# EAGLE design brick_serial_bluetooth_wt11i (EAGLE 7.2.0)
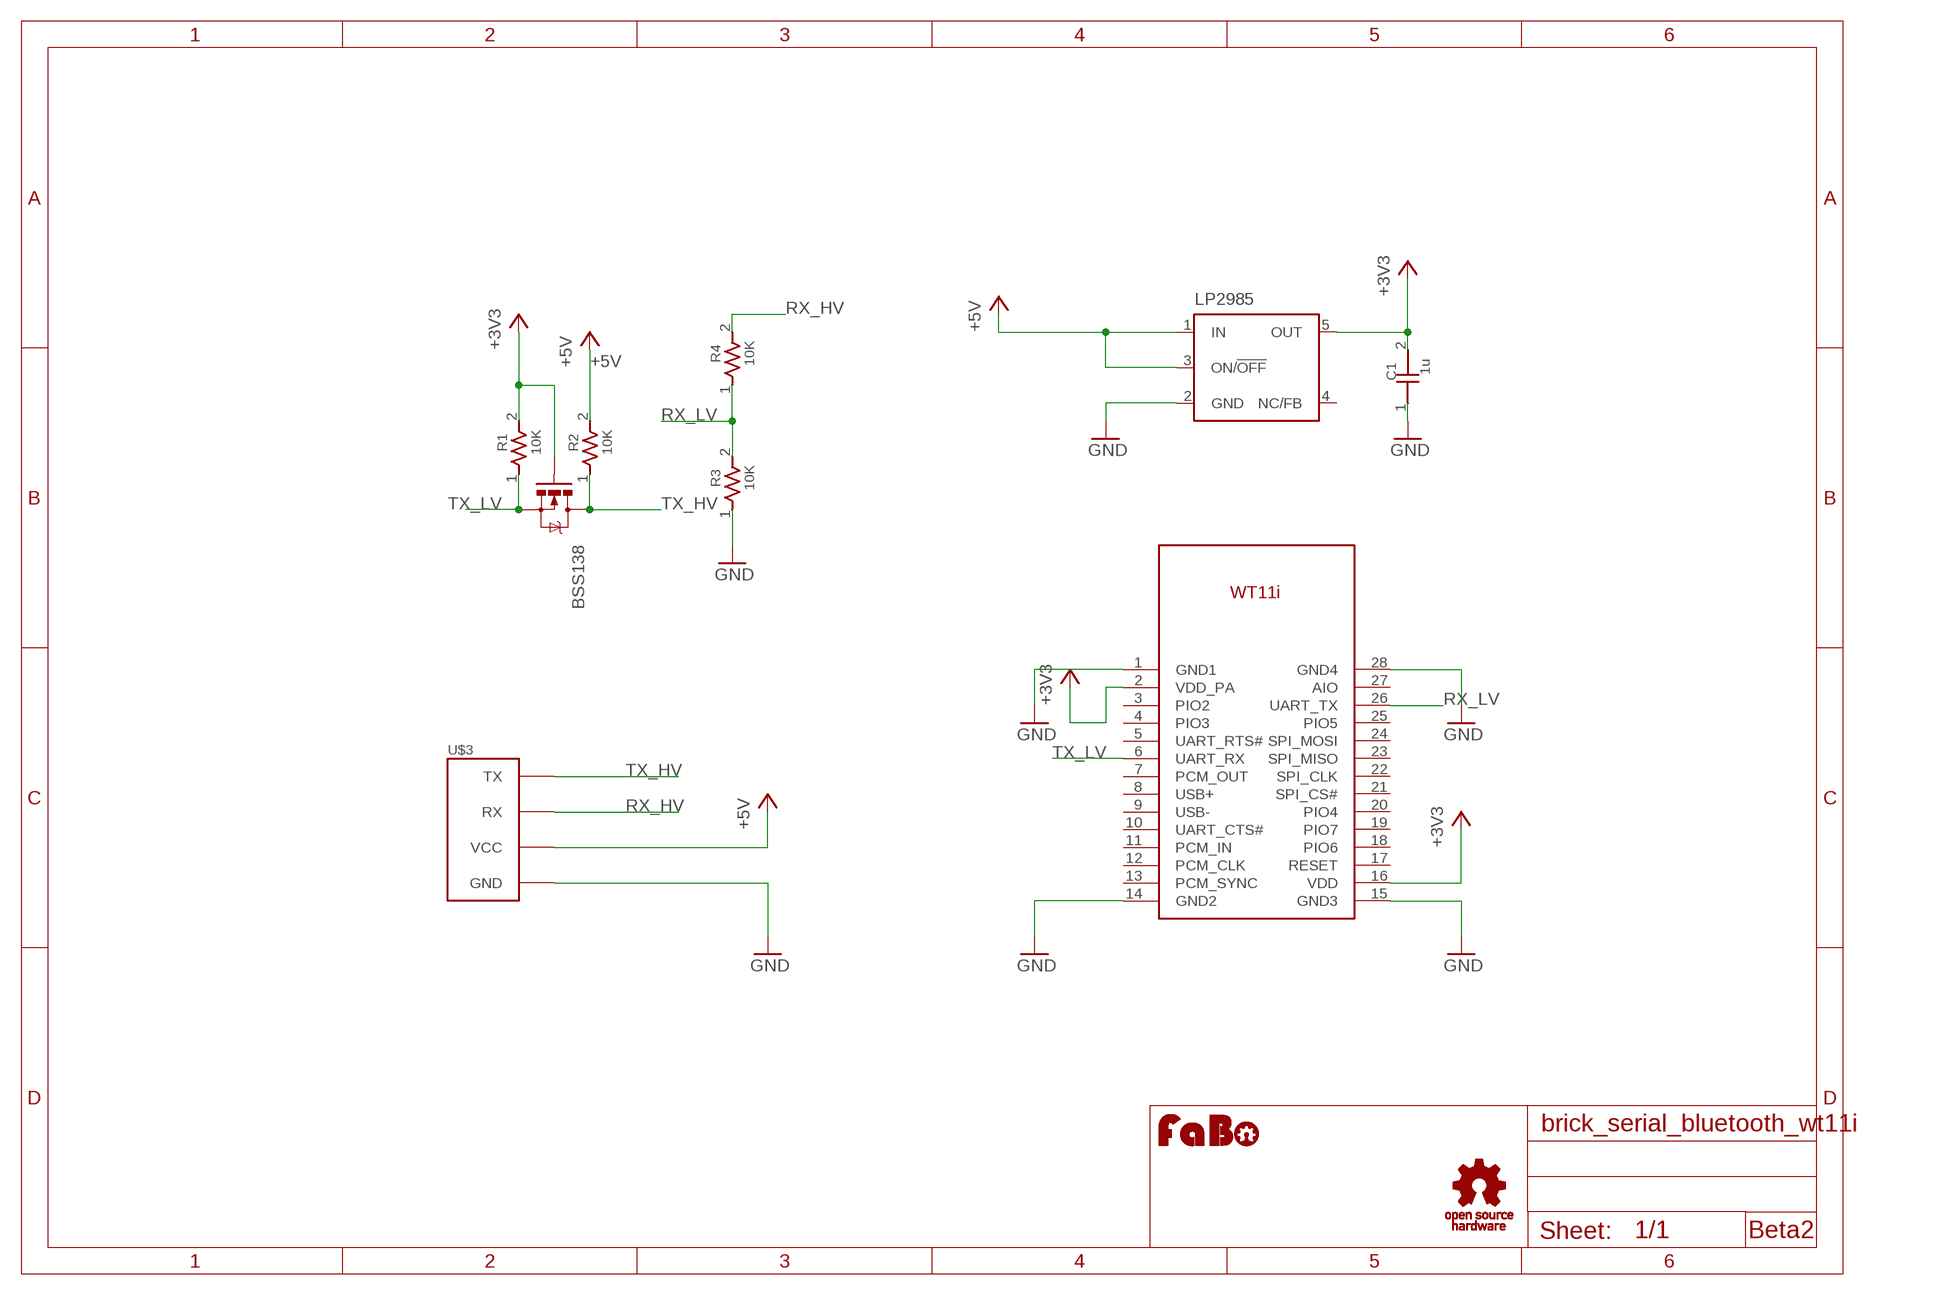
[diagram p0: schematic, sheet 1]

## Parts
BSS138  MOSFET-NCHANNELSMD  [SOT23-3]
C1  1u  CAPACITOR0603  [0603]
LP2985  LP2985-XXDBVR33  [SOT23-DBV]
R1  10K  RESISTOR0603  [0603]
R2  10K  RESISTOR0603  [0603]
R3  10K  RESISTOR0603  [0603]
R4  10K  RESISTOR0603  [0603]
U$1  BLUEGIGA-WT11I  [BLUEGIGA-WT11I]
U$3  BRICK_SERIAL  [BRICK_SERIAL]
U$4  LOGO_OSHW_T-S  [LOGO_OSHW_T_S]
U$5  LOGO_FABO-S  [LOGO_FABO_S]

## Nets
+3V3: BSS138.1(G) C1.2 LP2985.5(OUT) R1.2 U$1.2(VDD_PA) U$1.16(VDD)
+5V: LP2985.1(IN) LP2985.3(ON/!OFF) R2.2 U$3.VCC
GND: C1.1 LP2985.2(GND) R3.1 U$1.1(GND1) U$1.14(GND2) U$1.15(GND3) U$1.28(GND4) U$3.GND
RX_HV: R4.2 U$3.RX
RX_LV: R3.2 R4.1 U$1.26(UART_TX)
TX_HV: BSS138.3(D) R2.1 U$3.TX
TX_LV: BSS138.2(S) R1.1 U$1.6(UART_RX)
Unconnected: LP2985.4(NC/FB) U$1.3(PIO2) U$1.4(PIO3) U$1.5(UART_RTS#) U$1.7(PCM_OUT) U$1.8(USB+) U$1.9(USB-) U$1.10(UART_CTS#) U$1.11(PCM_IN) U$1.12(PCM_CLK) U$1.13(PCM_SYNC) U$1.17(RESET) U$1.18(PIO6) U$1.19(PIO7) U$1.20(PIO4) U$1.21(SPI_CS#) U$1.22(SPI_CLK) U$1.23(SPI_MISO) U$1.24(SPI_MOSI) U$1.25(PIO5) U$1.27(AIO)

## Notes on the sheet
- Beta2

## Library data of the parts
BSS138 = SparkFun:MOSFET-NCHANNEL
C1 = GClue-Capacitor:CAPACITOR
LP2985 = SmartPrj:LP2985-XXDBVR: ULTRALOW-POWER 50-mA LOW-DROPOUT LINEAR REGULATORS 50-mA Low-Dropout Regulator Source: http://focus.ti.com/lit/ds/symlink/tps77001.pdf
R1-R4 = GClue-Resistors:RESISTOR
U$1 = gclue:BLUEGIGA-WT11I
U$3 = gclue:BRICK_SERIAL: FaBo Brick 4pin(SERIAL)
U$4 = gclue:LOGO_OSHW_T
U$5 = FaBo:LOGO_FABO

## Net classes
0 default: clearance 0.254 mm

## Board
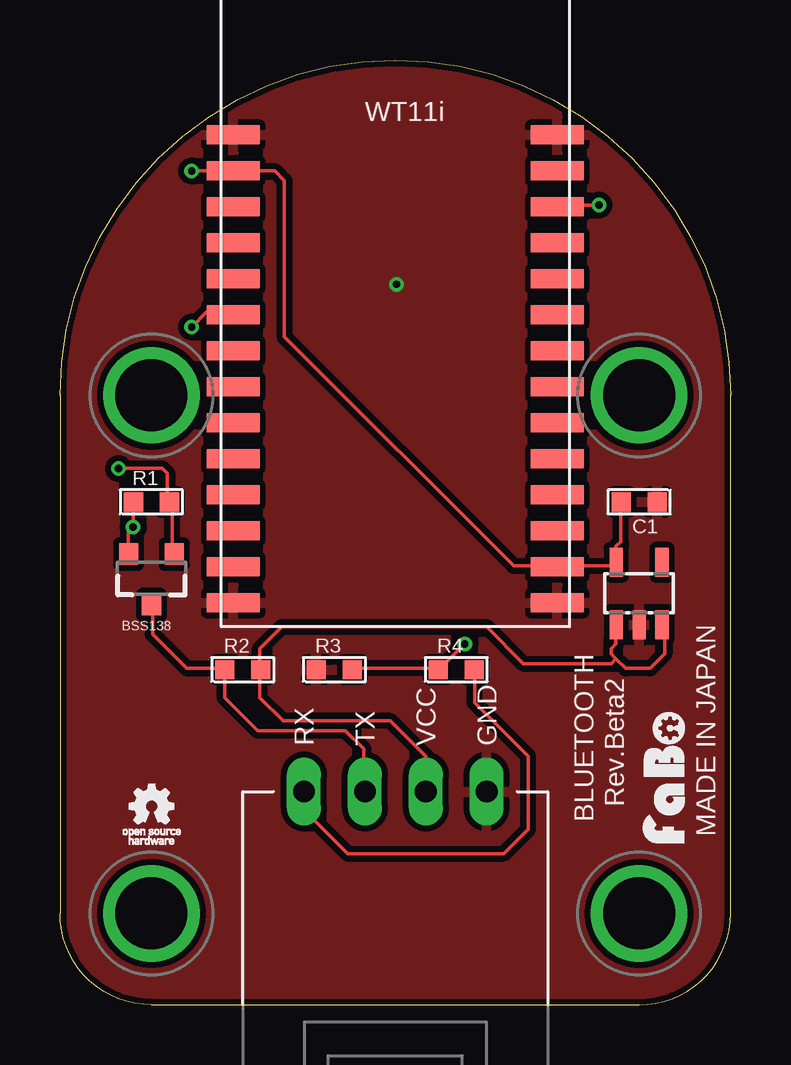
[diagram p1: board, top side]
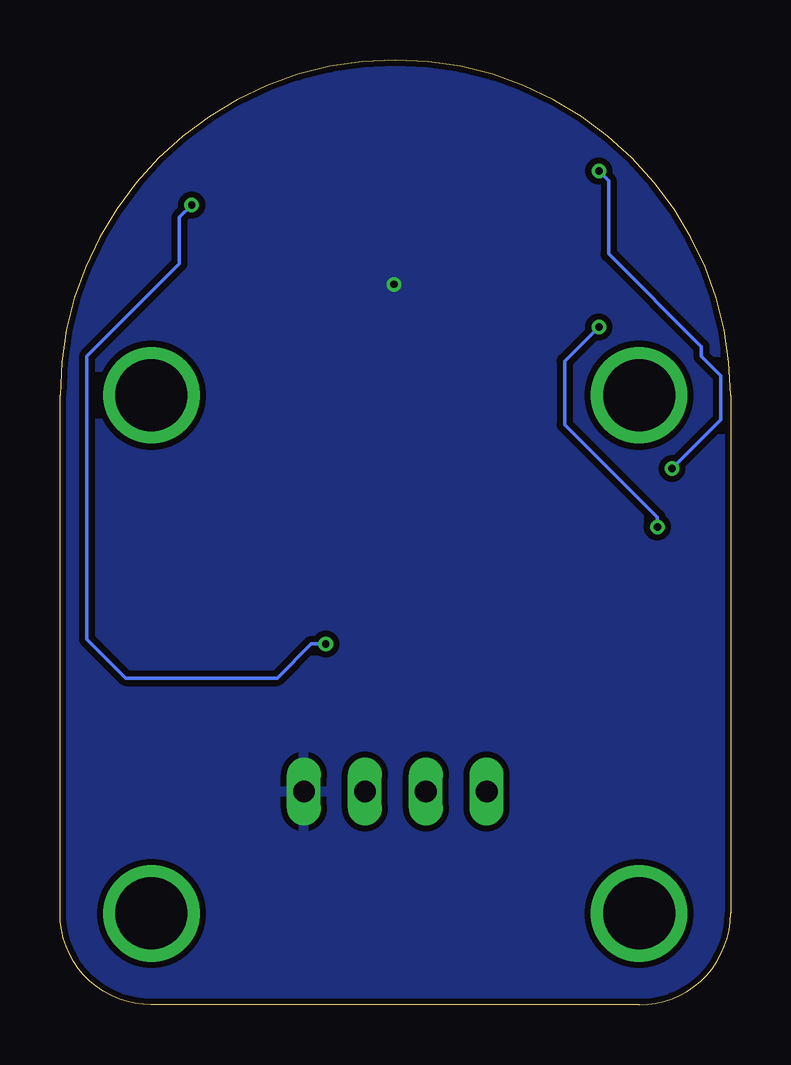
[diagram p2: board, bottom side, seen from below]

Size 27.94 x 39.37 mm. Coordinates in mm from the lower left corner, seen from the top.
Copper layers (1*16): Top 0.035mm / dielectric 1.5mm / Bottom 0.035mm
Design rules "Elecrow_2-layer_eagle_rule": minimum track width 6mil, minimum drill 12mil, track to track 6mil, track to pad 6mil, pad to pad 6mil, via to via 6mil, smd to smd 0mil, copper to edge 10mil, drill to drill 10mil, minimum pad ring 10mil, minimum via ring 6mil, stop-mask expansion 2mil, vias tented up to drill 100mil, thermal gap 10mil

### Footprints (pad centres in the part's own frame; a part is rotated, then mirrored left to right if it is on the bottom)
SOT23-3 = smd 0.8 x 0.9: 1 -0.95,-1; 2 0.95,-1; 3 0,1.1
0603 = smd 0.8 x 0.8: 1 -0.75,0; 2 0.75,0
SOT23-DBV = smd 0.55 x 1.2: 1 -0.95,-1.3; 2 0,-1.3; 3 0.95,-1.3; 4 0.95,1.3; 5 -0.95,1.3
BLUEGIGA-WT11I = smd 2.2 x 0.8: 1 -6.75,4.5; 2 -6.75,3; 3 -6.75,1.5; 4 -6.75,0; 5 -6.75,-1.5; 6 -6.75,-3; 7 -6.75,-4.5; 8 -6.75,-6; 9 -6.75,-7.5; 10 -6.75,-9; 11 -6.75,-10.5; 12 -6.75,-12; 13 -6.75,-13.5; 14 -6.75,-15; 15 6.75,-15; 16 6.75,-13.5; 17 6.75,-12; 18 6.75,-10.5; 19 6.75,-9; 20 6.75,-7.5; 21 6.75,-6; 22 6.75,-4.5; 23 6.75,-3; 24 6.75,-1.5; 25 6.75,0; 26 6.75,1.5; 27 6.75,3; 28 6.75,4.5
BRICK_SERIAL = drill 0.9 long: GND 3.81,-10.16; RX -3.81,-10.16; TX -1.27,-10.16; VCC 1.27,-10.16 | drill 3 pad 3.81: P$5 -10.16,6.35; P$6 10.16,6.35; P$7 -10.16,-15.24; P$8 10.16,-15.24

### Placement (x,y rotation side)
BSS138  3.81,17.78 180 top
C1  24.13,20.95 180 top
LP2985  24.13,17.14 0 top
R1  3.81,20.95 0 top
R2  7.62,13.97 0 top
R3  11.43,13.97 0 top
R4  16.51,13.97 0 top
U$1  13.97,31.75 0 top
U$3  13.97,19.05 0 top
U$4  3.81,8.26 0 top
U$5  26.04,9.53 90 top

### Tracks (layer width: path | path; a pad name or v marks a point on that pad's centre or on a via)
+3V3  (via drill 0.3)
  Top 0.152: C1.2 23.37,20.93 23.37,19.3 23.16,19.1 23.16,18.49 LP2985.5 23.16,18.29 20.73,18.29 U$1.16 20.52,18.29 18.9,18.29 9.35,27.84 9.35,34.34 8.94,34.75 7.32,34.75 U$1.2 7.11,34.75 v5.49,34.75 | BSS138.1 4.67,18.9 4.67,20.93 R1.2 4.47,21.13 4.47,22.15 4.27,22.35 v2.44,22.35
  Bottom 0.152: v2.44,22.35 0.41,24.38 0.41,26.21 1.22,27.03 1.22,27.43 5.08,31.29 5.08,34.34 v5.49,34.75
+5V
  Top 0.152: 23.16,14.43 23.57,14.02 24.59,14.02 25.2,14.63 25.2,15.65 LP2985.3 | 23.16,14.43 22.96,14.63 22.96,14.83 23.16,15.04 23.16,15.65 LP2985.1 | U$3.VCC 15.24,10.36 13.77,11.84 9.3,11.84 8.33,12.8 8.33,13.82 R2.2 8.33,14.02 8.33,14.83 9.25,15.75 17.78,15.75 19.3,14.22 22.96,14.22 23.16,14.43
GND  (via drill 0.3)
  other vias: 14.02,30.02
  pour Bottom: -1.27,-1.27 29.21,-1.27 29.21,40.64 -1.27,40.64
  pour Top: -1.27,-1.27 29.21,-1.27 29.21,40.64 -1.27,40.64
RX_HV
  Top 0.152: U$3.RX 10.16,8.13 11.99,6.3 18.49,6.3 19.51,7.32 19.51,10.36 17.27,12.6 17.27,13.82 R4.2
RX_LV  (via drill 0.3)
  Top 0.152: R3.2 12.19,14.02 15.65,14.02 R4.1 15.85,14.02 v16.87,15.04 | v22.45,33.33 20.73,33.33 U$1.26
  Bottom 0.152: v16.87,15.04 17.48,15.04 18.9,13.61 25.2,13.61 26.82,15.24 26.82,27.03 22.96,30.89 22.96,32.82 v22.45,33.33
TX_HV
  Top 0.152: BSS138.3 3.86,16.66 3.86,15.44 5.28,14.02 6.71,14.02 R2.1 6.86,13.87 6.86,12.8 8.23,11.43 11.89,11.43 12.65,10.67 12.65,8.99 U$3.TX
TX_LV  (via drill 0.3)
  Top 0.152: R1.1 3.05,20.93 v3.05,19.91 2.85,19.71 2.85,18.9 BSS138.2 | v5.49,28.25 6.1,28.85 7.11,28.85 U$1.6
  Bottom 0.152: v3.05,19.91 3.05,20.32 6.91,24.18 6.91,26.82 v5.49,28.25

### Text on the board
tPlace: WT11i | MADE IN JAPAN | BLUETOOTH | Rev.Beta2